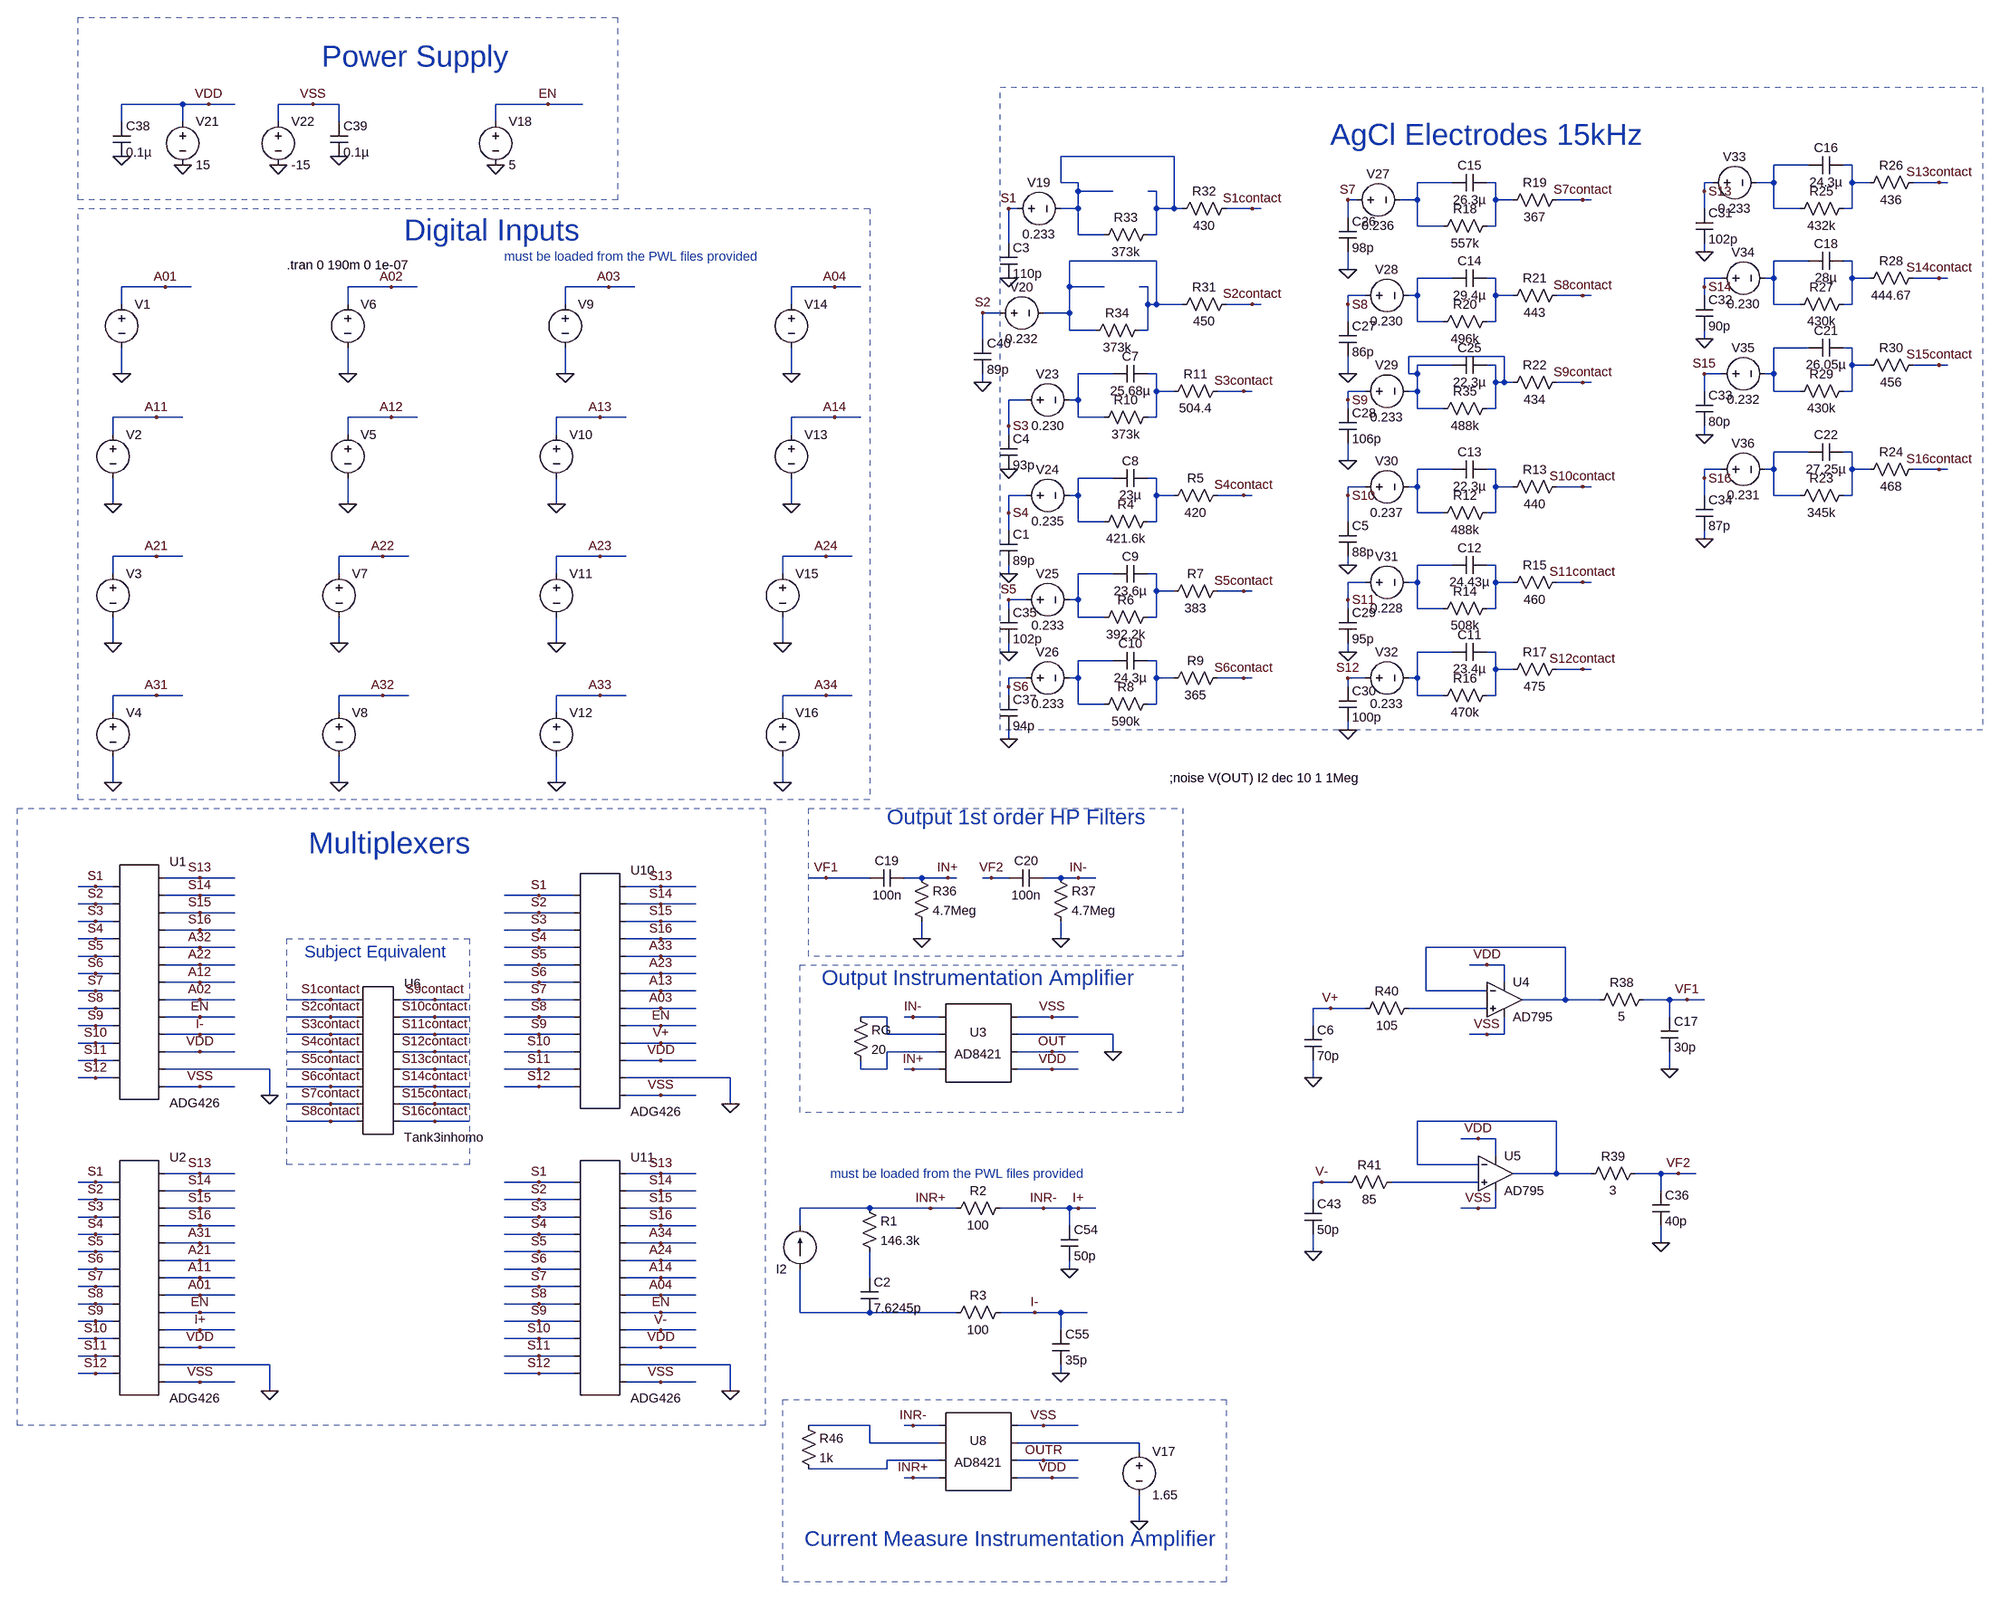
[diagram p0: schematic EIT_2019_15k_Mirrored_Current_Passive.asc]
EIT_2019_15k_Mirrored_Current_Passive.asc, the LTspice schematic file:
Version 4
SHEET 1 4952 2112
WIRE -1392 -1360 -1504 -1360
WIRE -1344 -1360 -1392 -1360
WIRE -1296 -1360 -1344 -1360
WIRE -1152 -1360 -1216 -1360
WIRE -1104 -1360 -1152 -1360
WIRE -720 -1360 -816 -1360
WIRE -656 -1360 -720 -1360
WIRE -1504 -1328 -1504 -1360
WIRE -1392 -1328 -1392 -1360
WIRE -1216 -1328 -1216 -1360
WIRE -1104 -1328 -1104 -1360
WIRE -816 -1328 -816 -1360
WIRE 432 -1264 224 -1264
WIRE 1600 -1248 1536 -1248
WIRE 1680 -1248 1664 -1248
WIRE 224 -1216 224 -1264
WIRE 256 -1216 224 -1216
WIRE 944 -1216 880 -1216
WIRE 1024 -1216 1008 -1216
WIRE 1424 -1216 1408 -1216
WIRE 1536 -1216 1536 -1248
WIRE 1536 -1216 1504 -1216
WIRE 1680 -1216 1680 -1248
WIRE 1712 -1216 1680 -1216
WIRE 1840 -1216 1792 -1216
WIRE 1856 -1216 1840 -1216
WIRE 256 -1200 256 -1216
WIRE 320 -1200 256 -1200
WIRE 400 -1200 384 -1200
WIRE 1408 -1200 1408 -1216
WIRE 768 -1184 752 -1184
WIRE 880 -1184 880 -1216
WIRE 880 -1184 848 -1184
WIRE 1024 -1184 1024 -1216
WIRE 1056 -1184 1024 -1184
WIRE 1184 -1184 1136 -1184
WIRE 1200 -1184 1184 -1184
WIRE 144 -1168 128 -1168
WIRE 256 -1168 256 -1200
WIRE 256 -1168 224 -1168
WIRE 400 -1168 400 -1200
WIRE 432 -1168 432 -1264
WIRE 432 -1168 400 -1168
WIRE 448 -1168 432 -1168
WIRE 576 -1168 528 -1168
WIRE 592 -1168 576 -1168
WIRE 1408 -1168 1408 -1200
WIRE 1536 -1168 1536 -1216
WIRE 1584 -1168 1536 -1168
WIRE 1680 -1168 1680 -1216
WIRE 1680 -1168 1664 -1168
WIRE 752 -1152 752 -1184
WIRE 880 -1136 880 -1184
WIRE 928 -1136 880 -1136
WIRE 1024 -1136 1024 -1184
WIRE 1024 -1136 1008 -1136
WIRE 256 -1120 256 -1168
WIRE 304 -1120 256 -1120
WIRE 400 -1120 400 -1168
WIRE 400 -1120 384 -1120
WIRE 128 -1104 128 -1168
WIRE 1408 -1088 1408 -1104
WIRE 400 -1072 240 -1072
WIRE 1600 -1072 1536 -1072
WIRE 1680 -1072 1664 -1072
WIRE 752 -1056 752 -1088
WIRE 944 -1040 880 -1040
WIRE 1024 -1040 1008 -1040
WIRE 1440 -1040 1408 -1040
WIRE 1536 -1040 1536 -1072
WIRE 1536 -1040 1520 -1040
WIRE 1680 -1040 1680 -1072
WIRE 1712 -1040 1680 -1040
WIRE 1840 -1040 1792 -1040
WIRE 1856 -1040 1840 -1040
WIRE -1424 -1024 -1504 -1024
WIRE -1376 -1024 -1424 -1024
WIRE -1008 -1024 -1088 -1024
WIRE -960 -1024 -1008 -1024
WIRE -608 -1024 -688 -1024
WIRE -560 -1024 -608 -1024
WIRE -192 -1024 -272 -1024
WIRE -144 -1024 -192 -1024
WIRE 240 -1024 240 -1072
WIRE 304 -1024 240 -1024
WIRE 384 -1024 368 -1024
WIRE 1408 -1024 1408 -1040
WIRE 784 -1008 752 -1008
WIRE 880 -1008 880 -1040
WIRE 880 -1008 864 -1008
WIRE 1024 -1008 1024 -1040
WIRE 1056 -1008 1024 -1008
WIRE 1184 -1008 1136 -1008
WIRE 1200 -1008 1184 -1008
WIRE 1408 -1008 1408 -1024
WIRE -1504 -992 -1504 -1024
WIRE -1088 -992 -1088 -1024
WIRE -688 -992 -688 -1024
WIRE -272 -992 -272 -1024
WIRE 384 -992 384 -1024
WIRE 400 -992 400 -1072
WIRE 400 -992 384 -992
WIRE 448 -992 400 -992
WIRE 576 -992 528 -992
WIRE 592 -992 576 -992
WIRE 752 -992 752 -1008
WIRE 1536 -992 1536 -1040
WIRE 1584 -992 1536 -992
WIRE 1680 -992 1680 -1040
WIRE 1680 -992 1664 -992
WIRE 112 -976 80 -976
WIRE 240 -976 240 -1024
WIRE 240 -976 192 -976
WIRE 752 -960 752 -992
WIRE 880 -960 880 -1008
WIRE 928 -960 880 -960
WIRE 1024 -960 1024 -1008
WIRE 1024 -960 1008 -960
WIRE 240 -944 240 -976
WIRE 288 -944 240 -944
WIRE 384 -944 384 -992
WIRE 384 -944 368 -944
WIRE 80 -928 80 -976
WIRE 1408 -928 1408 -944
WIRE 1600 -912 1536 -912
WIRE 1680 -912 1664 -912
WIRE 1040 -896 864 -896
WIRE 944 -880 880 -880
WIRE 1024 -880 1008 -880
WIRE 1680 -880 1680 -912
WIRE 1712 -880 1680 -880
WIRE 1840 -880 1792 -880
WIRE 1856 -880 1840 -880
WIRE -1504 -864 -1504 -912
WIRE -1088 -864 -1088 -912
WIRE -688 -864 -688 -912
WIRE -272 -864 -272 -912
WIRE 320 -864 256 -864
WIRE 400 -864 384 -864
WIRE 752 -864 752 -896
WIRE 864 -864 864 -896
WIRE 880 -864 880 -880
WIRE 880 -864 864 -864
WIRE 1440 -864 1408 -864
WIRE 1536 -864 1536 -912
WIRE 1536 -864 1520 -864
WIRE 80 -848 80 -864
WIRE 1024 -848 1024 -880
WIRE 1040 -848 1040 -896
WIRE 1040 -848 1024 -848
WIRE 1056 -848 1040 -848
WIRE 1184 -848 1136 -848
WIRE 1200 -848 1184 -848
WIRE 400 -832 400 -864
WIRE 432 -832 400 -832
WIRE 560 -832 512 -832
WIRE 576 -832 560 -832
WIRE 784 -832 752 -832
WIRE 880 -832 880 -864
WIRE 880 -832 864 -832
WIRE 1408 -832 1408 -864
WIRE 1536 -832 1536 -864
WIRE 1584 -832 1536 -832
WIRE 1680 -832 1680 -880
WIRE 1680 -832 1664 -832
WIRE 160 -816 128 -816
WIRE 256 -816 256 -864
WIRE 256 -816 240 -816
WIRE 752 -816 752 -832
WIRE 752 -800 752 -816
WIRE 880 -800 880 -832
WIRE 928 -800 880 -800
WIRE 1024 -800 1024 -848
WIRE 1024 -800 1008 -800
WIRE -1440 -784 -1520 -784
WIRE -1392 -784 -1440 -784
WIRE -1008 -784 -1088 -784
WIRE -960 -784 -1008 -784
WIRE -624 -784 -704 -784
WIRE -576 -784 -624 -784
WIRE -192 -784 -272 -784
WIRE -144 -784 -192 -784
WIRE 256 -784 256 -816
WIRE 304 -784 256 -784
WIRE 400 -784 400 -832
WIRE 400 -784 384 -784
WIRE 128 -768 128 -816
WIRE -1520 -752 -1520 -784
WIRE -1088 -752 -1088 -784
WIRE -704 -752 -704 -784
WIRE -272 -752 -272 -784
WIRE 128 -752 128 -768
WIRE 1408 -752 1408 -768
WIRE 1600 -720 1536 -720
WIRE 1680 -720 1664 -720
WIRE 752 -704 752 -736
WIRE 944 -688 880 -688
WIRE 1024 -688 1008 -688
WIRE 1440 -688 1408 -688
WIRE 1536 -688 1536 -720
WIRE 1536 -688 1520 -688
WIRE 1680 -688 1680 -720
WIRE 1712 -688 1680 -688
WIRE 1840 -688 1792 -688
WIRE 1856 -688 1840 -688
WIRE 320 -672 256 -672
WIRE 400 -672 384 -672
WIRE 1408 -672 1408 -688
WIRE 784 -656 752 -656
WIRE 880 -656 880 -688
WIRE 880 -656 864 -656
WIRE 1024 -656 1024 -688
WIRE 1056 -656 1024 -656
WIRE 1184 -656 1136 -656
WIRE 1200 -656 1184 -656
WIRE 160 -640 128 -640
WIRE 256 -640 256 -672
WIRE 256 -640 240 -640
WIRE 400 -640 400 -672
WIRE 432 -640 400 -640
WIRE 560 -640 512 -640
WIRE 576 -640 560 -640
WIRE 752 -640 752 -656
WIRE 1408 -640 1408 -672
WIRE 1536 -640 1536 -688
WIRE 1584 -640 1536 -640
WIRE 1680 -640 1680 -688
WIRE 1680 -640 1664 -640
WIRE -1520 -624 -1520 -672
WIRE -1088 -624 -1088 -672
WIRE -704 -624 -704 -672
WIRE -272 -624 -272 -672
WIRE 128 -608 128 -640
WIRE 880 -608 880 -656
WIRE 928 -608 880 -608
WIRE 1024 -608 1024 -656
WIRE 1024 -608 1008 -608
WIRE 256 -592 256 -640
WIRE 304 -592 256 -592
WIRE 400 -592 400 -640
WIRE 400 -592 384 -592
WIRE 752 -592 752 -640
WIRE 128 -576 128 -608
WIRE 1408 -560 1408 -576
WIRE -1440 -528 -1520 -528
WIRE -1392 -528 -1440 -528
WIRE -1024 -528 -1104 -528
WIRE -976 -528 -1024 -528
WIRE -624 -528 -704 -528
WIRE -576 -528 -624 -528
WIRE -208 -528 -288 -528
WIRE -160 -528 -208 -528
WIRE 752 -512 752 -528
WIRE 944 -512 880 -512
WIRE 1024 -512 1008 -512
WIRE -1520 -496 -1520 -528
WIRE -1104 -496 -1104 -528
WIRE -704 -496 -704 -528
WIRE -288 -496 -288 -528
WIRE 128 -496 128 -512
WIRE 320 -496 256 -496
WIRE 400 -496 384 -496
WIRE 784 -480 752 -480
WIRE 880 -480 880 -512
WIRE 880 -480 864 -480
WIRE 1024 -480 1024 -512
WIRE 1056 -480 1024 -480
WIRE 1184 -480 1136 -480
WIRE 1200 -480 1184 -480
WIRE 400 -464 400 -496
WIRE 432 -464 400 -464
WIRE 560 -464 512 -464
WIRE 576 -464 560 -464
WIRE 160 -448 128 -448
WIRE 256 -448 256 -496
WIRE 256 -448 240 -448
WIRE 752 -448 752 -480
WIRE 128 -432 128 -448
WIRE 752 -432 752 -448
WIRE 880 -432 880 -480
WIRE 928 -432 880 -432
WIRE 1024 -432 1024 -480
WIRE 1024 -432 1008 -432
WIRE 256 -416 256 -448
WIRE 304 -416 256 -416
WIRE 400 -416 400 -464
WIRE 400 -416 384 -416
WIRE -1520 -368 -1520 -416
WIRE -1104 -368 -1104 -416
WIRE -704 -368 -704 -416
WIRE -288 -368 -288 -416
WIRE 128 -352 128 -368
WIRE 752 -352 752 -368
WIRE 944 -352 880 -352
WIRE 1024 -352 1008 -352
WIRE 320 -336 256 -336
WIRE 400 -336 384 -336
WIRE 1024 -320 1024 -352
WIRE 1056 -320 1024 -320
WIRE 1184 -320 1136 -320
WIRE 1200 -320 1184 -320
WIRE 160 -304 128 -304
WIRE 256 -304 256 -336
WIRE 256 -304 240 -304
WIRE 400 -304 400 -336
WIRE 432 -304 400 -304
WIRE 560 -304 512 -304
WIRE 576 -304 560 -304
WIRE 784 -304 752 -304
WIRE 880 -304 880 -352
WIRE 880 -304 864 -304
WIRE 128 -288 128 -304
WIRE 752 -288 752 -304
WIRE -1440 -272 -1520 -272
WIRE -1392 -272 -1440 -272
WIRE -1024 -272 -1104 -272
WIRE -976 -272 -1024 -272
WIRE -624 -272 -704 -272
WIRE -576 -272 -624 -272
WIRE -208 -272 -288 -272
WIRE -160 -272 -208 -272
WIRE 128 -272 128 -288
WIRE 880 -272 880 -304
WIRE 928 -272 880 -272
WIRE 1024 -272 1024 -320
WIRE 1024 -272 1008 -272
WIRE 256 -256 256 -304
WIRE 304 -256 256 -256
WIRE 400 -256 400 -304
WIRE 400 -256 384 -256
WIRE -1520 -240 -1520 -272
WIRE -1104 -240 -1104 -272
WIRE -704 -240 -704 -272
WIRE -288 -240 -288 -272
WIRE 752 -208 752 -224
WIRE 128 -192 128 -208
WIRE -1520 -112 -1520 -160
WIRE -1104 -112 -1104 -160
WIRE -704 -112 -704 -160
WIRE -288 -112 -288 -160
WIRE -1360 64 -1424 64
WIRE -1296 64 -1360 64
WIRE -208 64 -240 64
WIRE -128 64 -208 64
WIRE -32 64 -64 64
WIRE 16 64 -32 64
WIRE 32 64 16 64
WIRE 96 64 80 64
WIRE 128 64 96 64
WIRE 224 64 192 64
WIRE 256 64 224 64
WIRE 288 64 256 64
WIRE -1552 80 -1584 80
WIRE -1520 80 -1552 80
WIRE -512 80 -576 80
WIRE -448 80 -512 80
WIRE -1360 96 -1424 96
WIRE -1296 96 -1360 96
WIRE -736 96 -800 96
WIRE -672 96 -736 96
WIRE -1552 112 -1584 112
WIRE -1520 112 -1552 112
WIRE -512 112 -576 112
WIRE -448 112 -512 112
WIRE -1360 128 -1424 128
WIRE -1296 128 -1360 128
WIRE -736 128 -800 128
WIRE -672 128 -736 128
WIRE -1552 144 -1584 144
WIRE -1520 144 -1552 144
WIRE -512 144 -576 144
WIRE -448 144 -512 144
WIRE -1360 160 -1424 160
WIRE -1296 160 -1360 160
WIRE -736 160 -800 160
WIRE -672 160 -736 160
WIRE -1552 176 -1584 176
WIRE -1520 176 -1552 176
WIRE -512 176 -576 176
WIRE -448 176 -512 176
WIRE -32 176 -32 144
WIRE 224 176 224 144
WIRE -1360 192 -1424 192
WIRE -1296 192 -1360 192
WIRE -736 192 -800 192
WIRE -672 192 -736 192
WIRE 1152 192 896 192
WIRE -1552 208 -1584 208
WIRE -1520 208 -1552 208
WIRE -512 208 -576 208
WIRE -448 208 -512 208
WIRE -1360 224 -1424 224
WIRE -1296 224 -1360 224
WIRE -736 224 -800 224
WIRE -672 224 -736 224
WIRE 1008 224 976 224
WIRE 1040 224 1008 224
WIRE -1552 240 -1584 240
WIRE -1520 240 -1552 240
WIRE -512 240 -576 240
WIRE -448 240 -512 240
WIRE -1360 256 -1424 256
WIRE -1296 256 -1360 256
WIRE -736 256 -800 256
WIRE -672 256 -736 256
WIRE 1040 256 1040 224
WIRE -1552 272 -1584 272
WIRE -1520 272 -1552 272
WIRE -512 272 -576 272
WIRE -448 272 -512 272
WIRE 896 272 896 192
WIRE 1008 272 896 272
WIRE -1360 288 -1424 288
WIRE -1296 288 -1360 288
WIRE -1120 288 -1200 288
WIRE -1072 288 -1120 288
WIRE -928 288 -992 288
WIRE -864 288 -928 288
WIRE -736 288 -800 288
WIRE -672 288 -736 288
WIRE 1152 288 1152 192
WIRE 1152 288 1072 288
WIRE 1216 288 1152 288
WIRE 1344 288 1296 288
WIRE 1376 288 1344 288
WIRE 1408 288 1376 288
WIRE -1552 304 -1584 304
WIRE -1520 304 -1552 304
WIRE -512 304 -576 304
WIRE -448 304 -512 304
WIRE 720 304 688 304
WIRE 784 304 720 304
WIRE 1008 304 864 304
WIRE -1360 320 -1424 320
WIRE -1296 320 -1360 320
WIRE -1120 320 -1200 320
WIRE -1072 320 -1120 320
WIRE -928 320 -992 320
WIRE -864 320 -928 320
WIRE -736 320 -800 320
WIRE -672 320 -736 320
WIRE -96 320 -144 320
WIRE -48 320 -64 320
WIRE 0 320 -48 320
WIRE 208 320 144 320
WIRE 256 320 208 320
WIRE 1344 320 1344 288
WIRE -1552 336 -1584 336
WIRE -1520 336 -1552 336
WIRE -512 336 -576 336
WIRE -448 336 -512 336
WIRE 688 336 688 304
WIRE -1360 352 -1424 352
WIRE -1296 352 -1360 352
WIRE -1120 352 -1200 352
WIRE -1072 352 -1120 352
WIRE -928 352 -992 352
WIRE -864 352 -928 352
WIRE -736 352 -800 352
WIRE -672 352 -736 352
WIRE -96 352 -96 320
WIRE 0 352 -96 352
WIRE 320 352 144 352
WIRE 1008 352 976 352
WIRE 1040 352 1040 320
WIRE 1040 352 1008 352
WIRE -1552 368 -1584 368
WIRE -1520 368 -1552 368
WIRE -512 368 -576 368
WIRE -448 368 -512 368
WIRE -1360 384 -1424 384
WIRE -1296 384 -1360 384
WIRE -1120 384 -1200 384
WIRE -1072 384 -1120 384
WIRE -928 384 -992 384
WIRE -864 384 -928 384
WIRE -736 384 -800 384
WIRE -672 384 -736 384
WIRE 0 384 -96 384
WIRE 208 384 144 384
WIRE 256 384 208 384
WIRE 320 384 320 352
WIRE -1552 400 -1584 400
WIRE -1520 400 -1552 400
WIRE -512 400 -576 400
WIRE -448 400 -512 400
WIRE -1232 416 -1424 416
WIRE -1120 416 -1200 416
WIRE -1072 416 -1120 416
WIRE -928 416 -992 416
WIRE -864 416 -928 416
WIRE -736 416 -800 416
WIRE -672 416 -736 416
WIRE -144 416 -144 400
WIRE -96 416 -96 384
WIRE -96 416 -144 416
WIRE -48 416 -64 416
WIRE 0 416 -48 416
WIRE 208 416 144 416
WIRE 256 416 208 416
WIRE 1344 416 1344 384
WIRE -1552 432 -1584 432
WIRE -1520 432 -1552 432
WIRE -384 432 -576 432
WIRE 688 432 688 400
WIRE -1360 448 -1424 448
WIRE -1296 448 -1360 448
WIRE -1120 448 -1200 448
WIRE -1072 448 -1120 448
WIRE -928 448 -992 448
WIRE -864 448 -928 448
WIRE -736 448 -800 448
WIRE -672 448 -736 448
WIRE -1232 464 -1232 416
WIRE -512 464 -576 464
WIRE -448 464 -512 464
WIRE -1120 480 -1200 480
WIRE -1072 480 -1120 480
WIRE -928 480 -992 480
WIRE -864 480 -928 480
WIRE -384 480 -384 432
WIRE -1120 512 -1200 512
WIRE -1072 512 -1120 512
WIRE -928 512 -992 512
WIRE -864 512 -928 512
WIRE 1136 512 880 512
WIRE 992 544 960 544
WIRE 1024 544 992 544
WIRE 1024 576 1024 544
WIRE 880 592 880 512
WIRE 992 592 880 592
WIRE -1360 608 -1424 608
WIRE -1296 608 -1360 608
WIRE -512 608 -576 608
WIRE -448 608 -512 608
WIRE 1136 608 1136 512
WIRE 1136 608 1056 608
WIRE 1200 608 1136 608
WIRE 1328 608 1280 608
WIRE 1360 608 1328 608
WIRE 1392 608 1360 608
WIRE -1552 624 -1584 624
WIRE -1520 624 -1552 624
WIRE -736 624 -800 624
WIRE -672 624 -736 624
WIRE 704 624 688 624
WIRE 752 624 704 624
WIRE 992 624 832 624
WIRE -1360 640 -1424 640
WIRE -1296 640 -1360 640
WIRE -512 640 -576 640
WIRE -448 640 -512 640
WIRE 1328 640 1328 608
WIRE -1552 656 -1584 656
WIRE -1520 656 -1552 656
WIRE -736 656 -800 656
WIRE -672 656 -736 656
WIRE 688 656 688 624
WIRE -1360 672 -1424 672
WIRE -1296 672 -1360 672
WIRE -512 672 -576 672
WIRE -448 672 -512 672
WIRE -128 672 -256 672
WIRE -16 672 -128 672
WIRE 32 672 -16 672
WIRE 192 672 112 672
WIRE 240 672 192 672
WIRE 256 672 240 672
WIRE 288 672 256 672
WIRE 992 672 960 672
WIRE 1024 672 1024 640
WIRE 1024 672 992 672
WIRE -1552 688 -1584 688
WIRE -1520 688 -1552 688
WIRE -736 688 -800 688
WIRE -672 688 -736 688
WIRE -1360 704 -1424 704
WIRE -1296 704 -1360 704
WIRE -512 704 -576 704
WIRE -448 704 -512 704
WIRE -256 704 -256 672
WIRE 240 704 240 672
WIRE -1552 720 -1584 720
WIRE -1520 720 -1552 720
WIRE -736 720 -800 720
WIRE -672 720 -736 720
WIRE -1360 736 -1424 736
WIRE -1296 736 -1360 736
WIRE -512 736 -576 736
WIRE -448 736 -512 736
WIRE 1328 736 1328 704
WIRE -1552 752 -1584 752
WIRE -1520 752 -1552 752
WIRE -736 752 -800 752
WIRE -672 752 -736 752
WIRE 688 752 688 720
WIRE -1360 768 -1424 768
WIRE -1296 768 -1360 768
WIRE -512 768 -576 768
WIRE -448 768 -512 768
WIRE -1552 784 -1584 784
WIRE -1520 784 -1552 784
WIRE -736 784 -800 784
WIRE -672 784 -736 784
WIRE 240 784 240 768
WIRE -1360 800 -1424 800
WIRE -1296 800 -1360 800
WIRE -512 800 -576 800
WIRE -448 800 -512 800
WIRE -128 800 -128 752
WIRE -1552 816 -1584 816
WIRE -1520 816 -1552 816
WIRE -736 816 -800 816
WIRE -672 816 -736 816
WIRE -1360 832 -1424 832
WIRE -1296 832 -1360 832
WIRE -512 832 -576 832
WIRE -448 832 -512 832
WIRE -1552 848 -1584 848
WIRE -1520 848 -1552 848
WIRE -736 848 -800 848
WIRE -672 848 -736 848
WIRE -1360 864 -1424 864
WIRE -1296 864 -1360 864
WIRE -512 864 -576 864
WIRE -448 864 -512 864
WIRE -256 864 -256 784
WIRE -128 864 -256 864
WIRE 32 864 -128 864
WIRE 176 864 112 864
WIRE 224 864 176 864
WIRE 272 864 224 864
WIRE -1552 880 -1584 880
WIRE -1520 880 -1552 880
WIRE -736 880 -800 880
WIRE -672 880 -736 880
WIRE -1360 896 -1424 896
WIRE -1296 896 -1360 896
WIRE -512 896 -576 896
WIRE -448 896 -512 896
WIRE 224 896 224 864
WIRE -1552 912 -1584 912
WIRE -1520 912 -1552 912
WIRE -736 912 -800 912
WIRE -672 912 -736 912
WIRE -1360 928 -1424 928
WIRE -1296 928 -1360 928
WIRE -512 928 -576 928
WIRE -448 928 -512 928
WIRE -1552 944 -1584 944
WIRE -1520 944 -1552 944
WIRE -736 944 -800 944
WIRE -672 944 -736 944
WIRE -1232 960 -1424 960
WIRE -384 960 -576 960
WIRE -1552 976 -1584 976
WIRE -1520 976 -1552 976
WIRE -736 976 -800 976
WIRE -672 976 -736 976
WIRE 224 976 224 960
WIRE -1360 992 -1424 992
WIRE -1296 992 -1360 992
WIRE -512 992 -576 992
WIRE -448 992 -512 992
WIRE -1232 1008 -1232 960
WIRE -384 1008 -384 960
WIRE -128 1072 -240 1072
WIRE -48 1072 -64 1072
WIRE 0 1072 -48 1072
WIRE 192 1072 144 1072
WIRE 256 1072 192 1072
WIRE -128 1104 -128 1072
WIRE 0 1104 -128 1104
WIRE 368 1104 144 1104
WIRE 368 1120 368 1104
WIRE 0 1136 -96 1136
WIRE 192 1136 144 1136
WIRE 256 1136 192 1136
WIRE -96 1152 -96 1136
WIRE -96 1152 -240 1152
WIRE -48 1168 -64 1168
WIRE 0 1168 -48 1168
WIRE 208 1168 144 1168
WIRE 256 1168 208 1168
WIRE 368 1248 368 1200
FLAG -1424 -1024 A01
FLAG -1504 -864 0
FLAG -1440 -784 A11
FLAG -1520 -624 0
FLAG -1440 -528 A21
FLAG -1520 -368 0
FLAG -1440 -272 A31
FLAG -1520 -112 0
FLAG -1008 -784 A12
FLAG -1088 -624 0
FLAG -1008 -1024 A02
FLAG -1088 -864 0
FLAG -1024 -528 A22
FLAG -1104 -368 0
FLAG -1024 -272 A32
FLAG -1104 -112 0
FLAG -608 -1024 A03
FLAG -688 -864 0
FLAG -624 -784 A13
FLAG -704 -624 0
FLAG -624 -528 A23
FLAG -704 -368 0
FLAG -624 -272 A33
FLAG -704 -112 0
FLAG -192 -784 A14
FLAG -272 -624 0
FLAG -192 -1024 A04
FLAG -272 -864 0
FLAG -208 -528 A24
FLAG -288 -368 0
FLAG -208 -272 A34
FLAG -288 -112 0
FLAG -1392 -1248 0
FLAG -1216 -1248 0
FLAG -1344 -1360 VDD
FLAG -1152 -1360 VSS
FLAG -1504 -1264 0
FLAG -1104 -1264 0
FLAG -1360 736 A31
FLAG -1360 768 A21
FLAG -1360 800 A11
FLAG -1360 832 A01
FLAG -1360 864 EN
FLAG -1360 896 I+
FLAG -1360 928 VDD
FLAG -1360 992 VSS
FLAG -1232 1008 0
FLAG -1360 192 A32
FLAG -1360 224 A22
FLAG -1360 256 A12
FLAG -1360 288 A02
FLAG -1360 320 EN
FLAG -1360 352 I-
FLAG -1360 384 VDD
FLAG -1360 448 VSS
FLAG -1232 464 0
FLAG -1120 288 S1contact
FLAG -1120 320 S2contact
FLAG -1120 352 S3contact
FLAG -1120 384 S4contact
FLAG -1120 416 S5contact
FLAG -1120 448 S6contact
FLAG -1120 480 S7contact
FLAG -1120 512 S8contact
FLAG -928 416 S13contact
FLAG -928 448 S14contact
FLAG -928 480 S15contact
FLAG -928 512 S16contact
FLAG -928 288 S9contact
FLAG -928 320 S10contact
FLAG -928 352 S11contact
FLAG -928 384 S12contact
FLAG -736 96 S1
FLAG -736 128 S2
FLAG -736 160 S3
FLAG -736 192 S4
FLAG -736 224 S5
FLAG -736 256 S6
FLAG -736 288 S7
FLAG -736 320 S8
FLAG -736 352 S9
FLAG -736 384 S10
FLAG -736 416 S11
FLAG -736 448 S12
FLAG -512 80 S13
FLAG -512 112 S14
FLAG -512 144 S15
FLAG -512 176 S16
FLAG -512 208 A33
FLAG -512 240 A23
FLAG -512 272 A13
FLAG -512 304 A03
FLAG -512 336 EN
FLAG -512 368 V+
FLAG -512 400 VDD
FLAG -512 464 VSS
FLAG -384 480 0
FLAG -736 624 S1
FLAG -736 656 S2
FLAG -736 688 S3
FLAG -736 720 S4
FLAG -736 752 S5
FLAG -736 784 S6
FLAG -736 816 S7
FLAG -736 848 S8
FLAG -736 880 S9
FLAG -736 912 S10
FLAG -736 944 S11
FLAG -736 976 S12
FLAG -512 608 S13
FLAG -512 640 S14
FLAG -512 672 S15
FLAG -512 704 S16
FLAG -512 736 A34
FLAG -512 768 A24
FLAG -512 800 A14
FLAG -512 832 A04
FLAG -512 864 EN
FLAG -512 896 V-
FLAG -512 928 VDD
FLAG -512 992 VSS
FLAG -384 1008 0
FLAG -32 176 0
FLAG 224 176 0
FLAG 16 64 IN+
FLAG 256 64 IN-
FLAG 208 416 VDD
FLAG -48 320 IN-
FLAG -48 416 IN+
FLAG 320 384 0
FLAG 208 320 VSS
FLAG 208 384 OUT
FLAG -720 -1360 EN
FLAG -816 -1248 0
FLAG 208 1168 VDD
FLAG 192 1072 VSS
FLAG -48 1072 INR-
FLAG -48 1168 INR+
FLAG 192 1136 OUTR
FLAG 368 1248 0
FLAG -16 672 INR+
FLAG 192 672 INR-
FLAG 256 672 I+
FLAG 176 864 I-
FLAG 1008 352 VSS
FLAG 1008 224 VDD
FLAG 1344 416 0
FLAG 992 672 VSS
FLAG 992 544 VDD
FLAG 1328 736 0
FLAG 240 784 0
FLAG 224 976 0
FLAG 1376 288 VF1
FLAG 1360 608 VF2
FLAG -208 64 VF1
FLAG 96 64 VF2
FLAG -1552 80 S1
FLAG -1552 112 S2
FLAG -1552 144 S3
FLAG -1552 176 S4
FLAG -1552 208 S5
FLAG -1552 240 S6
FLAG -1552 272 S7
FLAG -1552 304 S8
FLAG -1552 336 S9
FLAG -1552 368 S10
FLAG -1552 400 S11
FLAG -1552 432 S12
FLAG -1552 624 S1
FLAG -1552 656 S2
FLAG -1552 688 S3
FLAG -1552 720 S4
FLAG -1552 752 S5
FLAG -1552 784 S6
FLAG -1552 816 S7
FLAG -1552 848 S8
FLAG -1552 880 S9
FLAG -1552 912 S10
FLAG -1552 944 S11
FLAG -1552 976 S12
FLAG -1360 64 S13
FLAG -1360 96 S14
FLAG -1360 128 S15
FLAG -1360 160 S16
FLAG -1360 608 S13
FLAG -1360 640 S14
FLAG -1360 672 S15
FLAG -1360 704 S16
FLAG 720 304 V+
FLAG 688 432 0
FLAG 704 624 V-
FLAG 688 752 0
FLAG 560 -640 S4contact
FLAG 560 -464 S5contact
FLAG 560 -304 S6contact
FLAG 560 -832 S3contact
FLAG 1184 -656 S10contact
FLAG 1184 -480 S11contact
FLAG 1184 -320 S12contact
FLAG 1184 -1184 S7contact
FLAG 1184 -1008 S8contact
FLAG 1184 -848 S9contact
FLAG 1840 -688 S16contact
FLAG 1840 -1216 S13contact
FLAG 1840 -1040 S14contact
FLAG 1840 -880 S15contact
FLAG 576 -992 S2contact
FLAG 576 -1168 S1contact
FLAG 128 -1040 0
FLAG 128 -688 0
FLAG 752 -704 0
FLAG 752 -512 0
FLAG 128 -496 0
FLAG 752 -1056 0
FLAG 752 -864 0
FLAG 752 -352 0
FLAG 752 -208 0
FLAG 1408 -1088 0
FLAG 1408 -928 0
FLAG 1408 -752 0
FLAG 1408 -560 0
FLAG 128 -352 0
FLAG 128 -192 0
FLAG 128 -1168 S1
FLAG 80 -976 S2
FLAG 128 -768 S3
FLAG 128 -608 S4
FLAG 128 -448 S5
FLAG 80 -848 0
FLAG 128 -288 S6
FLAG 752 -1184 S7
FLAG 752 -992 S8
FLAG 752 -816 S9
FLAG 752 -640 S10
FLAG 752 -448 S11
FLAG 752 -304 S12
FLAG 1408 -1200 S13
FLAG 1408 -1024 S14
FLAG 1408 -864 S15
FLAG 1408 -672 S16
SYMBOL voltage -1504 -1008 R0
WINDOW 123 0 0 Left 2
WINDOW 39 0 0 Left 2
WINDOW 3 24 96 Invisible 2
SYMATTR Value PWL file="C:\Users\Chris\Desktop\PHD_files\EIT spice LT\PWL Files\Skipcurr0\15kHz\PWL_A01_skip-0.txt"
SYMATTR InstName V1
SYMBOL voltage -1520 -768 R0
WINDOW 123 0 0 Left 2
WINDOW 39 0 0 Left 2
WINDOW 3 24 96 Invisible 2
SYMATTR Value PWL file="C:\Users\Chris\Desktop\PHD_files\EIT spice LT\PWL Files\Skipcurr0\15kHz\PWL_A11_skip-0.txt"
SYMATTR InstName V2
SYMBOL voltage -1520 -512 R0
WINDOW 123 0 0 Left 2
WINDOW 39 0 0 Left 2
WINDOW 3 24 96 Invisible 2
SYMATTR Value PWL file="C:\Users\Chris\Desktop\PHD_files\EIT spice LT\PWL Files\Skipcurr0\15kHz\PWL_A21_skip-0.txt"
SYMATTR InstName V3
SYMBOL voltage -1520 -256 R0
WINDOW 123 0 0 Left 2
WINDOW 39 0 0 Left 2
WINDOW 3 24 96 Invisible 2
SYMATTR Value PWL file="C:\Users\Chris\Desktop\PHD_files\EIT spice LT\PWL Files\Skipcurr0\15kHz\PWL_A31_skip-0.txt"
SYMATTR InstName V4
SYMBOL voltage -1088 -768 R0
WINDOW 123 0 0 Left 2
WINDOW 39 0 0 Left 2
WINDOW 3 24 96 Invisible 2
SYMATTR Value PWL file="C:\Users\Chris\Desktop\PHD_files\EIT spice LT\PWL Files\Skipcurr0\15kHz\PWL_A12_skip-0.txt"
SYMATTR InstName V5
SYMBOL voltage -1088 -1008 R0
WINDOW 123 0 0 Left 2
WINDOW 39 0 0 Left 2
WINDOW 3 24 96 Invisible 2
SYMATTR Value PWL file="C:\Users\Chris\Desktop\PHD_files\EIT spice LT\PWL Files\Skipcurr0\15kHz\PWL_A02_skip-0.txt"
SYMATTR InstName V6
SYMBOL voltage -1104 -512 R0
WINDOW 123 0 0 Left 2
WINDOW 39 0 0 Left 2
WINDOW 3 24 96 Invisible 2
SYMATTR Value PWL file="C:\Users\Chris\Desktop\PHD_files\EIT spice LT\PWL Files\Skipcurr0\15kHz\PWL_A22_skip-0.txt"
SYMATTR InstName V7
SYMBOL voltage -1104 -256 R0
WINDOW 123 0 0 Left 2
WINDOW 39 0 0 Left 2
WINDOW 3 24 96 Invisible 2
SYMATTR Value PWL file="C:\Users\Chris\Desktop\PHD_files\EIT spice LT\PWL Files\Skipcurr0\15kHz\PWL_A32_skip-0.txt"
SYMATTR InstName V8
SYMBOL voltage -688 -1008 R0
WINDOW 123 0 0 Left 2
WINDOW 39 0 0 Left 2
WINDOW 3 24 96 Invisible 2
SYMATTR Value PWL file="C:\Users\Chris\Desktop\PHD_files\EIT spice LT\PWL Files\Skipcurr0\SkipVolt0\15kHz\PWL_A03_skip-0.txt"
SYMATTR InstName V9
SYMBOL voltage -704 -768 R0
WINDOW 123 0 0 Left 2
WINDOW 39 0 0 Left 2
WINDOW 3 24 96 Invisible 2
SYMATTR Value PWL file="C:\Users\Chris\Desktop\PHD_files\EIT spice LT\PWL Files\Skipcurr0\SkipVolt0\15kHz\PWL_A13_skip-0.txt"
SYMATTR InstName V10
SYMBOL voltage -704 -512 R0
WINDOW 123 0 0 Left 2
WINDOW 39 0 0 Left 2
WINDOW 3 24 96 Invisible 2
SYMATTR Value PWL file="C:\Users\Chris\Desktop\PHD_files\EIT spice LT\PWL Files\Skipcurr0\SkipVolt0\15kHz\PWL_A23_skip-0.txt"
SYMATTR InstName V11
SYMBOL voltage -704 -256 R0
WINDOW 123 0 0 Left 2
WINDOW 39 0 0 Left 2
WINDOW 3 24 96 Invisible 2
SYMATTR Value PWL file="C:\Users\Chris\Desktop\PHD_files\EIT spice LT\PWL Files\Skipcurr0\SkipVolt0\15kHz\PWL_A33_skip-0.txt"
SYMATTR InstName V12
SYMBOL voltage -272 -768 R0
WINDOW 123 0 0 Left 2
WINDOW 39 0 0 Left 2
WINDOW 3 24 96 Invisible 2
SYMATTR Value PWL file="C:\Users\Chris\Desktop\PHD_files\EIT spice LT\PWL Files\Skipcurr0\SkipVolt0\15kHz\PWL_A14_skip-0.txt"
SYMATTR InstName V13
SYMBOL voltage -272 -1008 R0
WINDOW 123 0 0 Left 2
WINDOW 39 0 0 Left 2
WINDOW 3 24 96 Invisible 2
SYMATTR Value PWL file="C:\Users\Chris\Desktop\PHD_files\EIT spice LT\PWL Files\Skipcurr0\SkipVolt0\15kHz\PWL_A04_skip-0.txt"
SYMATTR InstName V14
SYMBOL voltage -288 -512 R0
WINDOW 123 0 0 Left 2
WINDOW 39 0 0 Left 2
WINDOW 3 24 96 Invisible 2
SYMATTR Value PWL file="C:\Users\Chris\Desktop\PHD_files\EIT spice LT\PWL Files\Skipcurr0\SkipVolt0\15kHz\PWL_A24_skip-0.txt"
SYMATTR InstName V15
SYMBOL voltage -288 -256 R0
WINDOW 123 0 0 Left 2
WINDOW 39 0 0 Left 2
WINDOW 3 24 96 Invisible 2
SYMATTR Value PWL file="C:\Users\Chris\Desktop\PHD_files\EIT spice LT\PWL Files\Skipcurr0\SkipVolt0\15kHz\PWL_A34_skip-0.txt"
SYMATTR InstName V16
SYMBOL voltage -1392 -1344 R0
WINDOW 123 0 0 Left 2
WINDOW 39 0 0 Left 2
SYMATTR InstName V21
SYMATTR Value 15
SYMBOL voltage -1216 -1344 R0
WINDOW 123 0 0 Left 2
WINDOW 39 0 0 Left 2
SYMATTR InstName V22
SYMATTR Value -15
SYMBOL cap -1520 -1328 R0
SYMATTR InstName C38
SYMATTR Value 0.1µ
SYMBOL cap -1120 -1328 R0
SYMATTR InstName C39
SYMATTR Value 0.1µ
SYMBOL res -48 48 R0
SYMATTR InstName R36
SYMATTR Value 4.7Meg
SYMBOL cap -64 48 R90
WINDOW 0 0 32 VBottom 2
WINDOW 3 32 32 VTop 2
SYMATTR InstName C19
SYMATTR Value 100n
SYMBOL res 208 48 R0
SYMATTR InstName R37
SYMATTR Value 4.7Meg
SYMBOL cap 192 48 R90
WINDOW 0 0 32 VBottom 2
WINDOW 3 32 32 VTop 2
SYMATTR InstName C20
SYMATTR Value 100n
SYMBOL AutoGenerated\\AD8421 64 368 R0
SYMATTR InstName U3
SYMBOL res -160 304 R0
SYMATTR InstName RG
SYMATTR Value 20
SYMBOL voltage -816 -1344 R0
WINDOW 123 0 0 Left 2
WINDOW 39 0 0 Left 2
SYMATTR InstName V18
SYMATTR Value 5
SYMBOL AutoGenerated\\AD8421 64 1120 R0
SYMATTR InstName U8
SYMBOL res -256 1056 R0
SYMATTR InstName R46
SYMATTR Value 1k
SYMATTR SpiceLine tol=1 pwr=0.1
SYMBOL voltage 368 1104 R0
WINDOW 123 0 0 Left 0
WINDOW 39 0 0 Left 0
SYMATTR InstName V17
SYMATTR Value 1.65
SYMBOL AutoGenerated\\ADG426 -1472 256 R0
SYMATTR InstName U1
SYMBOL AutoGenerated\\ADG426 -1472 800 R0
SYMATTR InstName U2
SYMBOL AutoGenerated\\ADG426 -624 272 R0
SYMATTR InstName U10
SYMBOL AutoGenerated\\ADG426 -624 800 R0
SYMATTR InstName U11
SYMBOL res -144 656 R0
SYMATTR InstName R1
SYMATTR Value 146.3k
SYMBOL cap -144 800 R0
SYMATTR InstName C2
SYMATTR Value 7.6245p
SYMBOL current -256 784 R180
WINDOW 123 0 0 Left 0
WINDOW 39 0 0 Left 0
WINDOW 3 24 80 Invisible 2
SYMATTR Value PWL file="C:\Users\Chris\Desktop\PHD_files\EIT spice LT\PWL Files\Current_Source_Norton\15k\Current_Norton_Transient.txt"
SYMATTR InstName I2
SYMBOL res 128 656 R90
WINDOW 0 0 56 VBottom 2
WINDOW 3 32 56 VTop 2
SYMATTR InstName R2
SYMATTR Value 100
SYMBOL res 128 848 R90
WINDOW 0 0 56 VBottom 2
WINDOW 3 32 56 VTop 2
SYMATTR InstName R3
SYMATTR Value 100
SYMBOL Opamps\\AD795 1040 224 R0
SYMATTR InstName U4
SYMBOL res 1312 272 R90
WINDOW 0 0 56 VBottom 2
WINDOW 3 32 56 VTop 2
SYMATTR InstName R38
SYMATTR Value 5
SYMBOL cap 1328 320 R0
SYMATTR InstName C17
SYMATTR Value 30p
SYMBOL Opamps\\AD795 1024 544 R0
SYMATTR InstName U5
SYMBOL res 1296 592 R90
WINDOW 0 0 56 VBottom 2
WINDOW 3 32 56 VTop 2
SYMATTR InstName R39
SYMATTR Value 3
SYMBOL cap 1312 640 R0
SYMATTR InstName C36
SYMATTR Value 40p
SYMBOL cap 224 704 R0
SYMATTR InstName C54
SYMATTR Value 50p
SYMBOL cap 208 896 R0
SYMATTR InstName C55
SYMATTR Value 35p
SYMBOL cap 672 336 R0
SYMATTR InstName C6
SYMATTR Value 70p
SYMBOL cap 672 656 R0
SYMATTR InstName C43
SYMATTR Value 50p
SYMBOL res 880 288 R90
WINDOW 0 0 56 VBottom 2
WINDOW 3 32 56 VTop 2
SYMATTR InstName R40
SYMATTR Value 105
SYMBOL res 848 608 R90
WINDOW 0 0 56 VBottom 2
WINDOW 3 32 56 VTop 2
SYMATTR InstName R41
SYMATTR Value 85
SYMBOL res 400 -608 R90
WINDOW 0 0 56 VBottom 2
WINDOW 3 32 56 VTop 2
SYMATTR InstName R4
SYMATTR Value 421.6k
SYMBOL res 528 -656 R90
WINDOW 0 0 56 VBottom 2
WINDOW 3 32 56 VTop 2
SYMATTR InstName R5
SYMATTR Value 420
SYMBOL res 400 -432 R90
WINDOW 0 0 56 VBottom 2
WINDOW 3 32 56 VTop 2
SYMATTR InstName R6
SYMATTR Value 392.2k
SYMBOL res 528 -480 R90
WINDOW 0 0 56 VBottom 2
WINDOW 3 32 56 VTop 2
SYMATTR InstName R7
SYMATTR Value 383
SYMBOL cap 112 -576 R0
SYMATTR InstName C1
SYMATTR Value 89p
SYMBOL res 400 -272 R90
WINDOW 0 0 56 VBottom 2
WINDOW 3 32 56 VTop 2
SYMATTR InstName R8
SYMATTR Value 590k
SYMBOL res 528 -320 R90
WINDOW 0 0 56 VBottom 2
WINDOW 3 32 56 VTop 2
SYMATTR InstName R9
SYMATTR Value 365
SYMBOL cap 112 -1104 R0
SYMATTR InstName C3
SYMATTR Value 110p
SYMBOL res 400 -800 R90
WINDOW 0 0 56 VBottom 2
WINDOW 3 32 56 VTop 2
SYMATTR InstName R10
SYMATTR Value 373k
SYMBOL res 528 -848 R90
WINDOW 0 0 56 VBottom 2
WINDOW 3 32 56 VTop 2
SYMATTR InstName R11
SYMATTR Value 504.4
SYMBOL cap 112 -752 R0
SYMATTR InstName C4
SYMATTR Value 93p
SYMBOL res 1024 -624 R90
WINDOW 0 0 56 VBottom 2
WINDOW 3 32 56 VTop 2
SYMATTR InstName R12
SYMATTR Value 488k
SYMBOL res 1152 -672 R90
WINDOW 0 0 56 VBottom 2
WINDOW 3 32 56 VTop 2
SYMATTR InstName R13
SYMATTR Value 440
SYMBOL res 1024 -448 R90
WINDOW 0 0 56 VBottom 2
WINDOW 3 32 56 VTop 2
SYMATTR InstName R14
SYMATTR Value 508k
SYMBOL res 1152 -496 R90
WINDOW 0 0 56 VBottom 2
WINDOW 3 32 56 VTop 2
SYMATTR InstName R15
SYMATTR Value 460
SYMBOL cap 736 -592 R0
SYMATTR InstName C5
SYMATTR Value 88p
SYMBOL res 1024 -288 R90
WINDOW 0 0 56 VBottom 2
WINDOW 3 32 56 VTop 2
SYMATTR InstName R16
SYMATTR Value 470k
SYMBOL res 1152 -336 R90
WINDOW 0 0 56 VBottom 2
WINDOW 3 32 56 VTop 2
SYMATTR InstName R17
SYMATTR Value 475
SYMBOL res 1024 -1152 R90
WINDOW 0 0 56 VBottom 2
WINDOW 3 32 56 VTop 2
SYMATTR InstName R18
SYMATTR Value 557k
SYMBOL res 1152 -1200 R90
WINDOW 0 0 56 VBottom 2
WINDOW 3 32 56 VTop 2
SYMATTR InstName R19
SYMATTR Value 367
SYMBOL res 1024 -976 R90
WINDOW 0 0 56 VBottom 2
WINDOW 3 32 56 VTop 2
SYMATTR InstName R20
SYMATTR Value 496k
SYMBOL res 1152 -1024 R90
WINDOW 0 0 56 VBottom 2
WINDOW 3 32 56 VTop 2
SYMATTR InstName R21
SYMATTR Value 443
SYMBOL res 1152 -864 R90
WINDOW 0 0 56 VBottom 2
WINDOW 3 32 56 VTop 2
SYMATTR InstName R22
SYMATTR Value 434
SYMATTR SpiceLine tol=1 pwr=0.1
SYMBOL res 1680 -656 R90
WINDOW 0 0 56 VBottom 2
WINDOW 3 32 56 VTop 2
SYMATTR InstName R23
SYMATTR Value 345k
SYMBOL res 1808 -704 R90
WINDOW 0 0 56 VBottom 2
WINDOW 3 32 56 VTop 2
SYMATTR InstName R24
SYMATTR Value 468
SYMBOL res 1680 -1184 R90
WINDOW 0 0 56 VBottom 2
WINDOW 3 32 56 VTop 2
SYMATTR InstName R25
SYMATTR Value 432k
SYMBOL res 1808 -1232 R90
WINDOW 0 0 56 VBottom 2
WINDOW 3 32 56 VTop 2
SYMATTR InstName R26
SYMATTR Value 436
SYMBOL res 1680 -1008 R90
WINDOW 0 0 56 VBottom 2
WINDOW 3 32 56 VTop 2
SYMATTR InstName R27
SYMATTR Value 430k
SYMBOL res 1808 -1056 R90
WINDOW 0 0 56 VBottom 2
WINDOW 3 32 56 VTop 2
SYMATTR InstName R28
SYMATTR Value 444.67
SYMBOL res 1680 -848 R90
WINDOW 0 0 56 VBottom 2
WINDOW 3 32 56 VTop 2
SYMATTR InstName R29
SYMATTR Value 430k
SYMBOL res 1808 -896 R90
WINDOW 0 0 56 VBottom 2
WINDOW 3 32 56 VTop 2
SYMATTR InstName R30
SYMATTR Value 456
SYMBOL cap 384 -880 R90
WINDOW 0 0 32 VBottom 2
WINDOW 3 32 32 VTop 2
SYMATTR InstName C7
SYMATTR Value 25.68µ
SYMBOL cap 384 -688 R90
WINDOW 0 0 32 VBottom 2
WINDOW 3 32 32 VTop 2
SYMATTR InstName C8
SYMATTR Value 23µ
SYMBOL cap 384 -512 R90
WINDOW 0 0 32 VBottom 2
WINDOW 3 32 32 VTop 2
SYMATTR InstName C9
SYMATTR Value 23.6µ
SYMBOL cap 384 -352 R90
WINDOW 0 0 32 VBottom 2
WINDOW 3 32 32 VTop 2
SYMATTR InstName C10
SYMATTR Value 24.3µ
SYMBOL cap 1008 -368 R90
WINDOW 0 0 32 VBottom 2
WINDOW 3 32 32 VTop 2
SYMATTR InstName C11
SYMATTR Value 23.4µ
SYMBOL cap 1008 -528 R90
WINDOW 0 0 32 VBottom 2
WINDOW 3 32 32 VTop 2
SYMATTR InstName C12
SYMATTR Value 24.43µ
SYMBOL cap 1008 -704 R90
WINDOW 0 0 32 VBottom 2
WINDOW 3 32 32 VTop 2
SYMATTR InstName C13
SYMATTR Value 22.3µ
SYMBOL cap 1008 -1056 R90
WINDOW 0 0 32 VBottom 2
WINDOW 3 32 32 VTop 2
SYMATTR InstName C14
SYMATTR Value 29.4µ
SYMBOL cap 1008 -1232 R90
WINDOW 0 0 32 VBottom 2
WINDOW 3 32 32 VTop 2
SYMATTR InstName C15
SYMATTR Value 26.3µ
SYMBOL cap 1664 -1264 R90
WINDOW 0 0 32 VBottom 2
WINDOW 3 32 32 VTop 2
SYMATTR InstName C16
SYMATTR Value 24.3µ
SYMBOL cap 1664 -1088 R90
WINDOW 0 0 32 VBottom 2
WINDOW 3 32 32 VTop 2
SYMATTR InstName C18
SYMATTR Value 28µ
SYMBOL cap 1664 -928 R90
WINDOW 0 0 32 VBottom 2
WINDOW 3 32 32 VTop 2
SYMATTR InstName C21
SYMATTR Value 26.05µ
SYMBOL cap 1664 -736 R90
WINDOW 0 0 32 VBottom 2
WINDOW 3 32 32 VTop 2
SYMATTR InstName C22
SYMATTR Value 27.25µ
SYMBOL res 544 -1008 R90
WINDOW 0 0 56 VBottom 2
WINDOW 3 32 56 VTop 2
SYMATTR InstName R31
SYMATTR Value 450
SYMBOL res 544 -1184 R90
WINDOW 0 0 56 VBottom 2
WINDOW 3 32 56 VTop 2
SYMATTR InstName R32
SYMATTR Value 430
SYMBOL res 1024 -816 R90
WINDOW 0 0 56 VBottom 2
WINDOW 3 32 56 VTop 2
SYMATTR InstName R35
SYMATTR Value 488k
SYMBOL cap 1008 -896 R90
WINDOW 0 0 32 VBottom 2
WINDOW 3 32 32 VTop 2
SYMATTR InstName C25
SYMATTR Value 22.3µ
SYMBOL cap 736 -1152 R0
SYMATTR InstName C26
SYMATTR Value 98p
SYMBOL cap 736 -960 R0
SYMATTR InstName C27
SYMATTR Value 86p
SYMBOL cap 736 -800 R0
SYMATTR InstName C28
SYMATTR Value 106p
SYMBOL cap 736 -432 R0
SYMATTR InstName C29
SYMATTR Value 95p
SYMBOL cap 736 -288 R0
SYMATTR InstName C30
SYMATTR Value 100p
SYMBOL cap 1392 -1168 R0
SYMATTR InstName C31
SYMATTR Value 102p
SYMBOL cap 1392 -1008 R0
SYMATTR InstName C32
SYMATTR Value 90p
SYMBOL cap 1392 -832 R0
SYMATTR InstName C33
SYMATTR Value 80p
SYMBOL cap 1392 -640 R0
SYMATTR InstName C34
SYMATTR Value 87p
SYMBOL cap 112 -432 R0
SYMATTR InstName C35
SYMATTR Value 102p
SYMBOL cap 112 -272 R0
SYMATTR InstName C37
SYMATTR Value 94p
SYMBOL voltage 128 -1168 R270
WINDOW 0 32 56 VTop 2
WINDOW 3 -32 56 VBottom 2
WINDOW 123 0 0 Left 0
WINDOW 39 0 0 Left 0
SYMATTR InstName V19
SYMATTR Value 0.233
SYMBOL voltage 96 -976 R270
WINDOW 0 32 56 VTop 2
WINDOW 3 -32 56 VBottom 2
WINDOW 123 0 0 Left 0
WINDOW 39 0 0 Left 0
SYMATTR InstName V20
SYMATTR Value 0.232
SYMBOL voltage 144 -816 R270
WINDOW 0 32 56 VTop 2
WINDOW 3 -32 56 VBottom 2
WINDOW 123 0 0 Left 0
WINDOW 39 0 0 Left 0
SYMATTR InstName V23
SYMATTR Value 0.230
SYMBOL voltage 144 -640 R270
WINDOW 0 32 56 VTop 2
WINDOW 3 -32 56 VBottom 2
WINDOW 123 0 0 Left 0
WINDOW 39 0 0 Left 0
SYMATTR InstName V24
SYMATTR Value 0.235
SYMBOL voltage 144 -448 R270
WINDOW 0 32 56 VTop 2
WINDOW 3 -32 56 VBottom 2
WINDOW 123 0 0 Left 0
WINDOW 39 0 0 Left 0
SYMATTR InstName V25
SYMATTR Value 0.233
SYMBOL cap 64 -928 R0
SYMATTR InstName C40
SYMATTR Value 89p
SYMBOL voltage 144 -304 R270
WINDOW 0 32 56 VTop 2
WINDOW 3 -32 56 VBottom 2
WINDOW 123 0 0 Left 0
WINDOW 39 0 0 Left 0
SYMATTR InstName V26
SYMATTR Value 0.233
SYMBOL voltage 752 -1184 R270
WINDOW 0 32 56 VTop 2
WINDOW 3 -32 56 VBottom 2
WINDOW 123 0 0 Left 0
WINDOW 39 0 0 Left 0
SYMATTR InstName V27
SYMATTR Value 0.236
SYMBOL voltage 768 -1008 R270
WINDOW 0 32 56 VTop 2
WINDOW 3 -32 56 VBottom 2
WINDOW 123 0 0 Left 0
WINDOW 39 0 0 Left 0
SYMATTR InstName V28
SYMATTR Value 0.230
SYMBOL voltage 768 -832 R270
WINDOW 0 32 56 VTop 2
WINDOW 3 -32 56 VBottom 2
WINDOW 123 0 0 Left 0
WINDOW 39 0 0 Left 0
SYMATTR InstName V29
SYMATTR Value 0.233
SYMBOL voltage 768 -656 R270
WINDOW 0 32 56 VTop 2
WINDOW 3 -32 56 VBottom 2
WINDOW 123 0 0 Left 0
WINDOW 39 0 0 Left 0
SYMATTR InstName V30
SYMATTR Value 0.237
SYMBOL voltage 768 -480 R270
WINDOW 0 32 56 VTop 2
WINDOW 3 -32 56 VBottom 2
WINDOW 123 0 0 Left 0
WINDOW 39 0 0 Left 0
SYMATTR InstName V31
SYMATTR Value 0.228
SYMBOL voltage 768 -304 R270
WINDOW 0 32 56 VTop 2
WINDOW 3 -32 56 VBottom 2
WINDOW 123 0 0 Left 0
WINDOW 39 0 0 Left 0
SYMATTR InstName V32
SYMATTR Value 0.233
SYMBOL voltage 1408 -1216 R270
WINDOW 0 32 56 VTop 2
WINDOW 3 -32 56 VBottom 2
WINDOW 123 0 0 Left 0
WINDOW 39 0 0 Left 0
SYMATTR InstName V33
SYMATTR Value 0.233
SYMBOL voltage 1424 -1040 R270
WINDOW 0 32 56 VTop 2
WINDOW 3 -32 56 VBottom 2
WINDOW 123 0 0 Left 0
WINDOW 39 0 0 Left 0
SYMATTR InstName V34
SYMATTR Value 0.230
SYMBOL voltage 1424 -864 R270
WINDOW 0 32 56 VTop 2
WINDOW 3 -32 56 VBottom 2
WINDOW 123 0 0 Left 0
WINDOW 39 0 0 Left 0
SYMATTR InstName V35
SYMATTR Value 0.232
SYMBOL voltage 1424 -688 R270
WINDOW 0 32 56 VTop 2
WINDOW 3 -32 56 VBottom 2
WINDOW 123 0 0 Left 0
WINDOW 39 0 0 Left 0
SYMATTR InstName V36
SYMATTR Value 0.231
SYMBOL res 400 -1136 R90
WINDOW 0 0 56 VBottom 2
WINDOW 3 32 56 VTop 2
SYMATTR InstName R33
SYMATTR Value 373k
SYMBOL res 384 -960 R90
WINDOW 0 0 56 VBottom 2
WINDOW 3 32 56 VTop 2
SYMATTR InstName R34
SYMATTR Value 373k
SYMBOL AutoGenerated\\Tank3inhomo -1040 400 R0
SYMATTR InstName U6
TEXT -96 -48 Left 4 ;Output 1st order HP Filters
TEXT 424 -120 Left 2 !;noise V(OUT) I2 dec 10 1 1Meg
TEXT -1160 0 Left 5 ;Multiplexers
TEXT -984 -1128 Left 5 ;Digital Inputs
TEXT -1136 -1448 Left 5 ;Power Supply
TEXT -216 248 Left 4 ;Output Instrumentation Amplifier
TEXT -1168 200 Left 3 ;Subject Equivalent
TEXT -248 1280 Left 4 ;Current Measure Instrumentation Amplifier
TEXT 720 -1304 Left 5 ;AgCl Electrodes 15kHz
TEXT -1200 -1064 Left 2 !.tran 0 190m 0 1e-07
TEXT -200 608 Left 2 ;must be loaded from the PWL files provided
TEXT -800 -1080 Left 2 ;must be loaded from the PWL files provided
RECTANGLE Normal -592 -1184 -1584 -1520 2
RECTANGLE Normal -128 -80 -1584 -1168 2
RECTANGLE Normal 448 208 -240 -64 2
RECTANGLE Normal -320 1072 -1696 -64 2
RECTANGLE Normal -864 592 -1200 176 2
RECTANGLE Normal 448 496 -256 224 2
RECTANGLE Normal 528 1360 -288 1024 2
RECTANGLE Normal 1920 -208 112 -1392 2

The netlist it stands for:
* EIT_2019_15k_Mirrored_Current_Passive.asc
V1 A01 0 PWL file="C:\Users\Chris\Desktop\PHD_files\EIT spice LT\PWL Files\Skipcurr0\15kHz\PWL_A01_skip-0.txt"
V2 A11 0 PWL file="C:\Users\Chris\Desktop\PHD_files\EIT spice LT\PWL Files\Skipcurr0\15kHz\PWL_A11_skip-0.txt"
V3 A21 0 PWL file="C:\Users\Chris\Desktop\PHD_files\EIT spice LT\PWL Files\Skipcurr0\15kHz\PWL_A21_skip-0.txt"
V4 A31 0 PWL file="C:\Users\Chris\Desktop\PHD_files\EIT spice LT\PWL Files\Skipcurr0\15kHz\PWL_A31_skip-0.txt"
V5 A12 0 PWL file="C:\Users\Chris\Desktop\PHD_files\EIT spice LT\PWL Files\Skipcurr0\15kHz\PWL_A12_skip-0.txt"
V6 A02 0 PWL file="C:\Users\Chris\Desktop\PHD_files\EIT spice LT\PWL Files\Skipcurr0\15kHz\PWL_A02_skip-0.txt"
V7 A22 0 PWL file="C:\Users\Chris\Desktop\PHD_files\EIT spice LT\PWL Files\Skipcurr0\15kHz\PWL_A22_skip-0.txt"
V8 A32 0 PWL file="C:\Users\Chris\Desktop\PHD_files\EIT spice LT\PWL Files\Skipcurr0\15kHz\PWL_A32_skip-0.txt"
V9 A03 0 PWL file="C:\Users\Chris\Desktop\PHD_files\EIT spice LT\PWL Files\Skipcurr0\SkipVolt0\15kHz\PWL_A03_skip-0.txt"
V10 A13 0 PWL file="C:\Users\Chris\Desktop\PHD_files\EIT spice LT\PWL Files\Skipcurr0\SkipVolt0\15kHz\PWL_A13_skip-0.txt"
V11 A23 0 PWL file="C:\Users\Chris\Desktop\PHD_files\EIT spice LT\PWL Files\Skipcurr0\SkipVolt0\15kHz\PWL_A23_skip-0.txt"
V12 A33 0 PWL file="C:\Users\Chris\Desktop\PHD_files\EIT spice LT\PWL Files\Skipcurr0\SkipVolt0\15kHz\PWL_A33_skip-0.txt"
V13 A14 0 PWL file="C:\Users\Chris\Desktop\PHD_files\EIT spice LT\PWL Files\Skipcurr0\SkipVolt0\15kHz\PWL_A14_skip-0.txt"
V14 A04 0 PWL file="C:\Users\Chris\Desktop\PHD_files\EIT spice LT\PWL Files\Skipcurr0\SkipVolt0\15kHz\PWL_A04_skip-0.txt"
V15 A24 0 PWL file="C:\Users\Chris\Desktop\PHD_files\EIT spice LT\PWL Files\Skipcurr0\SkipVolt0\15kHz\PWL_A24_skip-0.txt"
V16 A34 0 PWL file="C:\Users\Chris\Desktop\PHD_files\EIT spice LT\PWL Files\Skipcurr0\SkipVolt0\15kHz\PWL_A34_skip-0.txt"
V21 VDD 0 15
V22 VSS 0 -15
C38 VDD 0 0.1µ
C39 VSS 0 0.1µ
R36 IN+ 0 4.7Meg
C19 IN+ VF1 100n
R37 IN- 0 4.7Meg
C20 IN- VF2 100n
* U3: AD8421 (symbol AutoGenerated\AD8421 not available, pins judged from their places): pin1=IN- pin2=N032 pin3=N033 pin4=IN+ pin5=VSS pin6=0 pin7=OUT pin8=VDD
RG N032 N033 20
V18 EN 0 5
* U8: AD8421 (symbol AutoGenerated\AD8421 not available, pins judged from their places): pin1=INR- pin2=N038 pin3=N040 pin4=INR+ pin5=VSS pin6=N039 pin7=OUTR pin8=VDD
R46 N038 N040 1k tol=1 pwr=0.1
V17 N039 0 1.65
* U1: ADG426 (symbol AutoGenerated\ADG426 not available, pins judged from their places): pin1=S1 pin2=S2 pin3=S3 pin4=S4 pin5=S5 pin6=S6 pin7=S7 pin8=S8 pin9=S9 pin10=S10 pin11=S11 pin12=S12 pin13=S13 pin14=S14 pin15=S15 pin16=S16 pin17=A32 pin18=A22 pin19=A12 pin20=A02 pin21=EN pin22=I- pin23=VDD pin24=0 pin25=VSS
* U2: ADG426 (symbol AutoGenerated\ADG426 not available, pins judged from their places): pin1=S1 pin2=S2 pin3=S3 pin4=S4 pin5=S5 pin6=S6 pin7=S7 pin8=S8 pin9=S9 pin10=S10 pin11=S11 pin12=S12 pin13=S13 pin14=S14 pin15=S15 pin16=S16 pin17=A31 pin18=A21 pin19=A11 pin20=A01 pin21=EN pin22=INR- pin23=VDD pin24=0 pin25=VSS
* U10: ADG426 (symbol AutoGenerated\ADG426 not available, pins judged from their places): pin1=S1 pin2=S2 pin3=S3 pin4=S4 pin5=S5 pin6=S6 pin7=S7 pin8=S8 pin9=S9 pin10=S10 pin11=S11 pin12=S12 pin13=S13 pin14=S14 pin15=S15 pin16=S16 pin17=A33 pin18=A23 pin19=A13 pin20=A03 pin21=EN pin22=V+ pin23=VDD pin24=0 pin25=VSS
* U11: ADG426 (symbol AutoGenerated\ADG426 not available, pins judged from their places): pin1=S1 pin2=S2 pin3=S3 pin4=S4 pin5=S5 pin6=S6 pin7=S7 pin8=S8 pin9=S9 pin10=S10 pin11=S11 pin12=S12 pin13=S13 pin14=S14 pin15=S15 pin16=S16 pin17=A34 pin18=A24 pin19=A14 pin20=A04 pin21=EN pin22=V- pin23=VDD pin24=0 pin25=VSS
R1 INR+ N036 146.3k
C2 N036 N037 7.6245p
I2 N037 INR+ PWL file="C:\Users\Chris\Desktop\PHD_files\EIT spice LT\PWL Files\Current_Source_Norton\15k\Current_Norton_Transient.txt"
R2 INR- INR+ 100
R3 I- N037 100
XU4 N031 N030 VDD VSS N030 AD795  ; pins In+ In- V+ V- OUT
R38 VF1 N030 5
C17 VF1 0 30p
XU5 N035 N034 VDD VSS N034 AD795  ; pins In+ In- V+ V- OUT
R39 VF2 N034 3
C36 VF2 0 40p
C54 INR- 0 50p
C55 I- 0 35p
C6 V+ 0 70p
C43 V- 0 50p
R40 N031 V+ 105
R41 N035 V- 85
R4 N021 N020 421.6k
R5 S4contact N021 420
R6 N025 N024 392.2k
R7 S5contact N025 383
C1 S4 0 89p
R8 N029 N028 590k
R9 S6contact N029 365
C3 S1 0 110p
R10 N015 N014 373k
R11 S3contact N015 504.4
C4 S3 0 93p
R12 N019 N018 488k
R13 S10contact N019 440
R14 N023 N022 508k
R15 S11contact N023 460
C5 S10 0 88p
R16 N027 N026 470k
R17 S12contact N027 475
R18 N005 N004 557k
R19 S7contact N005 367
R20 N010 N009 496k
R21 S8contact N010 443
R22 S9contact N013 434 tol=1 pwr=0.1
R23 N017 N016 345k
R24 S16contact N017 468
R25 N003 N002 432k
R26 S13contact N003 436
R27 N008 N007 430k
R28 S14contact N008 444.67
R29 N012 N011 430k
R30 S15contact N012 456
C7 N015 N014 25.68µ
C8 N021 N020 23µ
C9 N025 N024 23.6µ
C10 N029 N028 24.3µ
C11 N027 N026 23.4µ
C12 N023 N022 24.43µ
C13 N019 N018 22.3µ
C14 N010 N009 29.4µ
C15 N005 N004 26.3µ
C16 N003 N002 24.3µ
C18 N008 N007 28µ
C21 N012 N011 26.05µ
C22 N017 N016 27.25µ
R31 S2contact N006 450
R32 S1contact N001 430
R35 N013 N013 488k
C25 N013 N013 22.3µ
C26 S7 0 98p
C27 S8 0 86p
C28 S9 0 106p
C29 S11 0 95p
C30 S12 0 100p
C31 S13 0 102p
C32 S14 0 90p
C33 S15 0 80p
C34 S16 0 87p
C35 S5 0 102p
C37 S6 0 94p
V19 S1 N001 0.233
V20 S2 N006 0.232
V23 S3 N014 0.230
V24 S4 N020 0.235
V25 S5 N024 0.233
C40 S2 0 89p
V26 S6 N028 0.233
V27 S7 N004 0.236
V28 S8 N009 0.230
V29 S9 N013 0.233
V30 S10 N018 0.237
V31 S11 N022 0.228
V32 S12 N026 0.233
V33 S13 N002 0.233
V34 S14 N007 0.230
V35 S15 N011 0.232
V36 S16 N016 0.231
R33 N001 N001 373k
R34 N006 N006 373k
* U6: Tank3inhomo (symbol AutoGenerated\Tank3inhomo not available, pins judged from their places): pin1=S1contact pin2=S2contact pin3=S3contact pin4=S4contact pin5=S5contact pin6=S6contact pin7=S7contact pin8=S8contact pin9=S9contact pin10=S10contact pin11=S11contact pin12=S12contact pin13=S13contact pin14=S14contact pin15=S15contact pin16=S16contact
* Output 1st order HP Filters
;noise V(OUT) I2 dec 10 1 1Meg
* Multiplexers
* Digital Inputs
* Power Supply
* Output Instrumentation Amplifier
* Subject Equivalent
* Current Measure Instrumentation Amplifier
* AgCl Electrodes 15kHz
.tran 0 190m 0 1e-07
* must be loaded from the PWL files provided
* must be loaded from the PWL files provided
.lib ADI1.lib
.backanno
.end